# EasyEDA schematic SCH_SGU-Base.json
TITLE: Sheet_1; REV: 1.0; Date: 2022-06-18; Sheet: 1/1; Company: Your Company
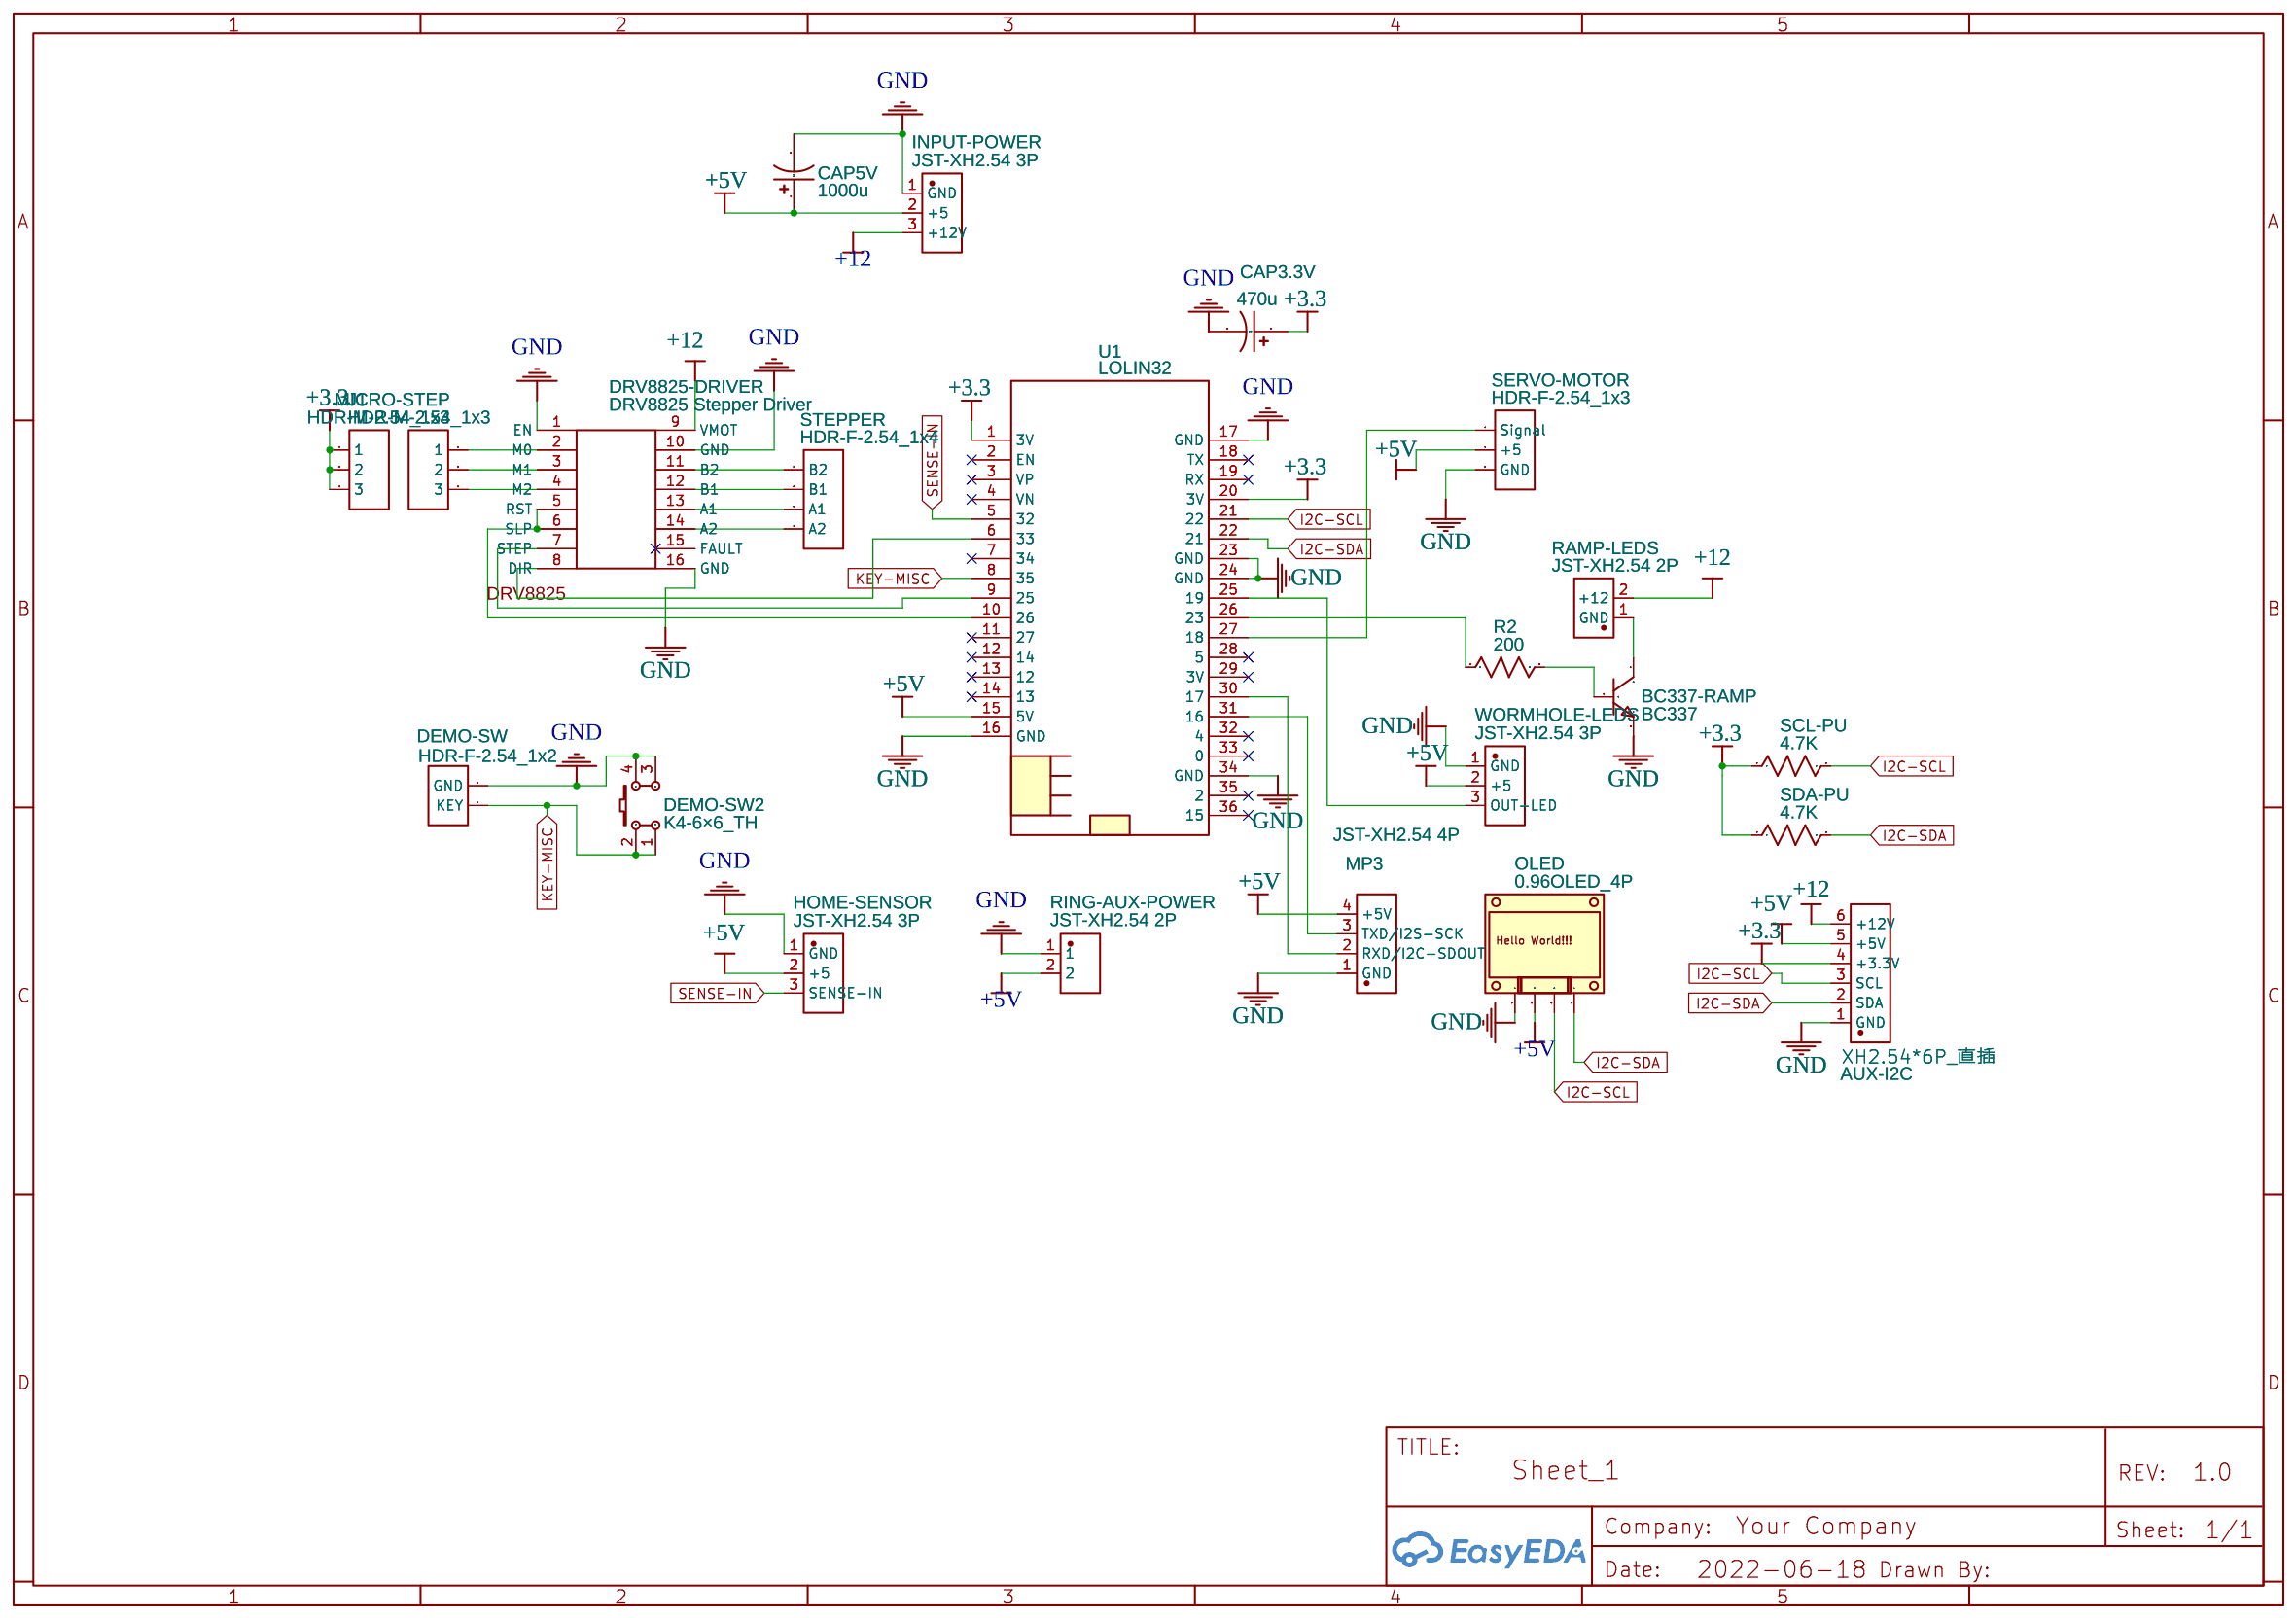
[diagram p0: schematic sheet]

## Parts
AUX-I2C  XH2.54*6P_直插  [CONN-TH_XH2.54-6P]
BC337-RAMP  BC337  [BC337]
CAP3.3V  470u  [CAP-D4.0×F1.5]
CAP5V  1000u  [CAP-D6.0XF1.5]
DEMO-SW  HDR-F-2.54_1x2  [HDR-F-2.54_1X2]
DEMO-SW2  K4-6×6_TH  [KEY-TH_4P-L6.0-W6.0-P4.50-LS6.5]
DRV8825-DRIVER  DRV8825 Stepper Driver  [DRV8825]
HOME-SENSOR  JST-XH2.54 3P  [JST-XH2.54 3P]
INPUT-POWER  JST-XH2.54 3P  [JST-XH2.54 3P]
J1  HDR-M-2.54_1x3  [HDR-M-2.54_1X3]
MICRO-STEP  HDR-M-2.54_1x3  [HDR-M-2.54_1X3]
MP3  JST-XH2.54 4P  [JST-XH2.54 4P]
OLED  0.96OLED_4P  [0.96OLED_4P]
R2  200  [R_AXIAL-0.3]
RAMP-LEDS  JST-XH2.54 2P  [JST-XH2.54 2P]
RING-AUX-POWER  JST-XH2.54 2P  [JST-XH2.54 2P]
SCL-PU  4.7K  [R_AXIAL-0.3]
SDA-PU  4.7K  [R_AXIAL-0.3]
SERVO-MOTOR  HDR-F-2.54_1x3  [HDR-F-2.54_1X3]
STEPPER  HDR-F-2.54_1x4  [HDR-F-2.54_1X4]
U1  LOLIN32  [LOLIN32]
WORMHOLE-LEDS  JST-XH2.54 3P  [JST-XH2.54 3P]

## Library data of the parts
AUX-I2C = XH2.54*6P_直插: Supplier: LCSC; Supplier Part: C9900008614; Manufacturer: null; JLCPCB Part Class: Extended Part; Contributor: LCSC
BC337-RAMP = BC337: Contributor: HTDvN
CAP3.3V CAP5V = CE_TH_D4.0×F1.5_US: Contributor: LCEDA_Lib
DEMO-SW = HDR-F-2.54_1x2: Supplier Part: C49661; Supplier: LCSC; Contributor: LCEDA_Lib
DEMO-SW2 = K4-6×6_TH: Supplier: LCSC; Supplier Part: C136684; Manufacturer: 韩国韩荣; Manufacturer Part: K2-1102DP-E4SW-04; Contributor: LCEDA_Lib
DRV8825-DRIVER = DRV8825 Stepper Driver: Contributor: Guest; Package Display: Yes
HOME-SENSOR INPUT-POWER WORMHOLE-LEDS = JST-XH2.54 3P: Supplier: CQRobot; link: https://www.amazon.fr/dp/B01EQGNZ2I/?coliid=IQPWZUUK7M1P0&colid=2CFFEVMK4YZ12&ref_=lv_ov_lig_dp_it_im&th=1; Contributor: marierigal4
J1 MICRO-STEP = HDR-M-2.54_1x3: Supplier Part: C180248; Supplier: LCSC; Contributor: LCEDA_Lib
MP3 = JST-XH2.54 4P: Supplier: CQRobot; link: https://www.amazon.fr/dp/B01EQGNZ2I/?coliid=IQPWZUUK7M1P0&colid=2CFFEVMK4YZ12&ref_=lv_ov_lig_dp_it_im&th=1; Contributor: marierigal4
OLED = 0.96OLED_4P: Supplier: LCSC; Contributor: LCEDA_Lib
R2 SCL-PU SDA-PU = R_AXIAL-0.3_US: Contributor: LCEDA_Lib
RAMP-LEDS RING-AUX-POWER = JST-XH2.54 2P: Supplier: CQRobot; link: https://www.amazon.fr/dp/B01EQGNZ2I/?coliid=IQPWZUUK7M1P0&colid=2CFFEVMK4YZ12&ref_=lv_ov_lig_dp_it_im&th=1; Contributor: marierigal4
SERVO-MOTOR = HDR-F-2.54_1x3: Supplier Part: C146690; Supplier: LCSC; Contributor: Fabian11
STEPPER = HDR-F-2.54_1x4: Supplier Part: C225501; Supplier: LCSC; Contributor: LCEDA_Lib
U1 = LOLIN32: Manufacturer: WeMos; Contributor: icet-t1

## Nets
+5V: AUX-I2C.5(+5V) CAP5V.1 HOME-SENSOR.2(+5) INPUT-POWER.2(+5) MP3.4(+5V) OLED.2 RING-AUX-POWER.2 SERVO-MOTOR.2(+5) U1.15(5V) WORMHOLE-LEDS.2(+5)
GND: AUX-I2C.1(GND) BC337-RAMP.3(E) CAP3.3V.2 CAP5V.2 DEMO-SW.2(GND) DEMO-SW2.3 DEMO-SW2.4 DRV8825-DRIVER.1(EN) DRV8825-DRIVER.10(GND) DRV8825-DRIVER.16(GND) HOME-SENSOR.1(GND) INPUT-POWER.1(GND) MP3.1(GND) OLED.1 RING-AUX-POWER.1 SERVO-MOTOR.3(GND) U1.16(GND) U1.17(GND) U1.23(GND) U1.24(GND) U1.34(GND) WORMHOLE-LEDS.1(GND)
+3.3: AUX-I2C.4(+3.3V) CAP3.3V.1 J1.1 J1.2 J1.3 SCL-PU.1 SDA-PU.1 U1.1(3V) U1.20(3V)
+12: AUX-I2C.6(+12V) DRV8825-DRIVER.9(VMOT) INPUT-POWER.3(+12V) RAMP-LEDS.2(+12)
I2C-SCL: AUX-I2C.3(SCL) OLED.3 SCL-PU.2 U1.21(22)
I2C-SDA: AUX-I2C.2(SDA) OLED.4 SDA-PU.2 U1.22(21)
KEY-MISC: DEMO-SW.1(KEY) DEMO-SW2.1 DEMO-SW2.2 U1.8(35)
SENSE-IN: HOME-SENSOR.3(SENSE-IN) U1.5(32)
Net-(BC337-RAMP-1): BC337-RAMP.1(C) RAMP-LEDS.1(GND)
Net-(BC337-RAMP-2): BC337-RAMP.2(B) R2.2
Net-(DRV8825-DRIVER-2): DRV8825-DRIVER.2(M0) MICRO-STEP.1
Net-(DRV8825-DRIVER-3): DRV8825-DRIVER.3(M1) MICRO-STEP.2
Net-(DRV8825-DRIVER-4): DRV8825-DRIVER.4(M2) MICRO-STEP.3
Net-(DRV8825-DRIVER-5): DRV8825-DRIVER.5(RST) DRV8825-DRIVER.6(SLP) U1.10(26)
Net-(DRV8825-DRIVER-7): DRV8825-DRIVER.7(STEP) U1.9(25)
Net-(DRV8825-DRIVER-8): DRV8825-DRIVER.8(DIR) U1.6(33)
Net-(DRV8825-DRIVER-11): DRV8825-DRIVER.11(B2) STEPPER.1(B2)
Net-(DRV8825-DRIVER-12): DRV8825-DRIVER.12(B1) STEPPER.2(B1)
Net-(DRV8825-DRIVER-13): DRV8825-DRIVER.13(A1) STEPPER.3(A1)
Net-(DRV8825-DRIVER-14): DRV8825-DRIVER.14(A2) STEPPER.4(A2)
Net-(MP3-2): MP3.2(RXD/I2C-SDOUT) U1.30(17)
Net-(MP3-3): MP3.3(TXD/I2S-SCK) U1.31(16)
Net-(R2-1): R2.1 U1.26(23)
Net-(SERVO-MOTOR-1): SERVO-MOTOR.1(Signal) U1.27(18)
Net-(U1-25): U1.25(19) WORMHOLE-LEDS.3(OUT-LED)

Not connected (* = marked no-connect by the designer): DRV8825-DRIVER 15(FAULT)*; U1 2(EN)* 3(VP)* 4(VN)* 7(34)* 11(27)* 12(14)* 13(12)* 14(13)* 18(TX)* 19(RX)* 28(5)* 29(3V)* 32(4)* 33(0)* 35(2)* 36(15)*
